# EAGLE schematic Arduino Bluetooth (EAGLE 8.0.1)
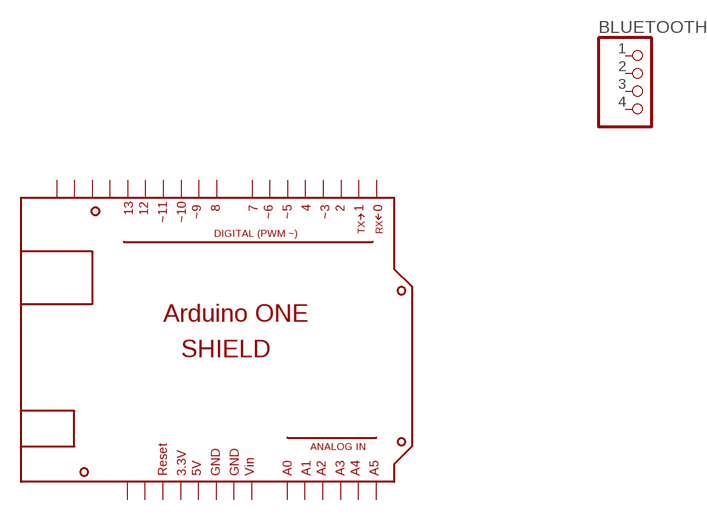
[diagram p0: schematic, sheet 1]

## Parts
BLUETOOTH  PINHD-1X4  [1X04]
U$1  SHIELD  [SHIELD]
Unconnected: BLUETOOTH.1 BLUETOOTH.2 BLUETOOTH.3 BLUETOOTH.4 U$1.0 U$1.1 U$1.2 U$1.3 U$1.3.3V U$1.4 U$1.5 U$1.5V U$1.6 U$1.7 U$1.8 U$1.9 U$1.10 U$1.11 U$1.12 U$1.13 U$1.14 U$1.15 U$1.16 U$1.17 U$1.A0 U$1.A1 U$1.A2 U$1.A3 U$1.A4 U$1.A5 U$1.GND1 U$1.GND2 U$1.IOREF U$1.NONE U$1.RST U$1.VIN

## Library data of the parts
BLUETOOTH = pinhead:PINHD-1X4: PIN HEADER
U$1 = E-Lab:SHIELD